# EAGLE schematic PCB-RPIBO1 (EAGLE 6.5.0)
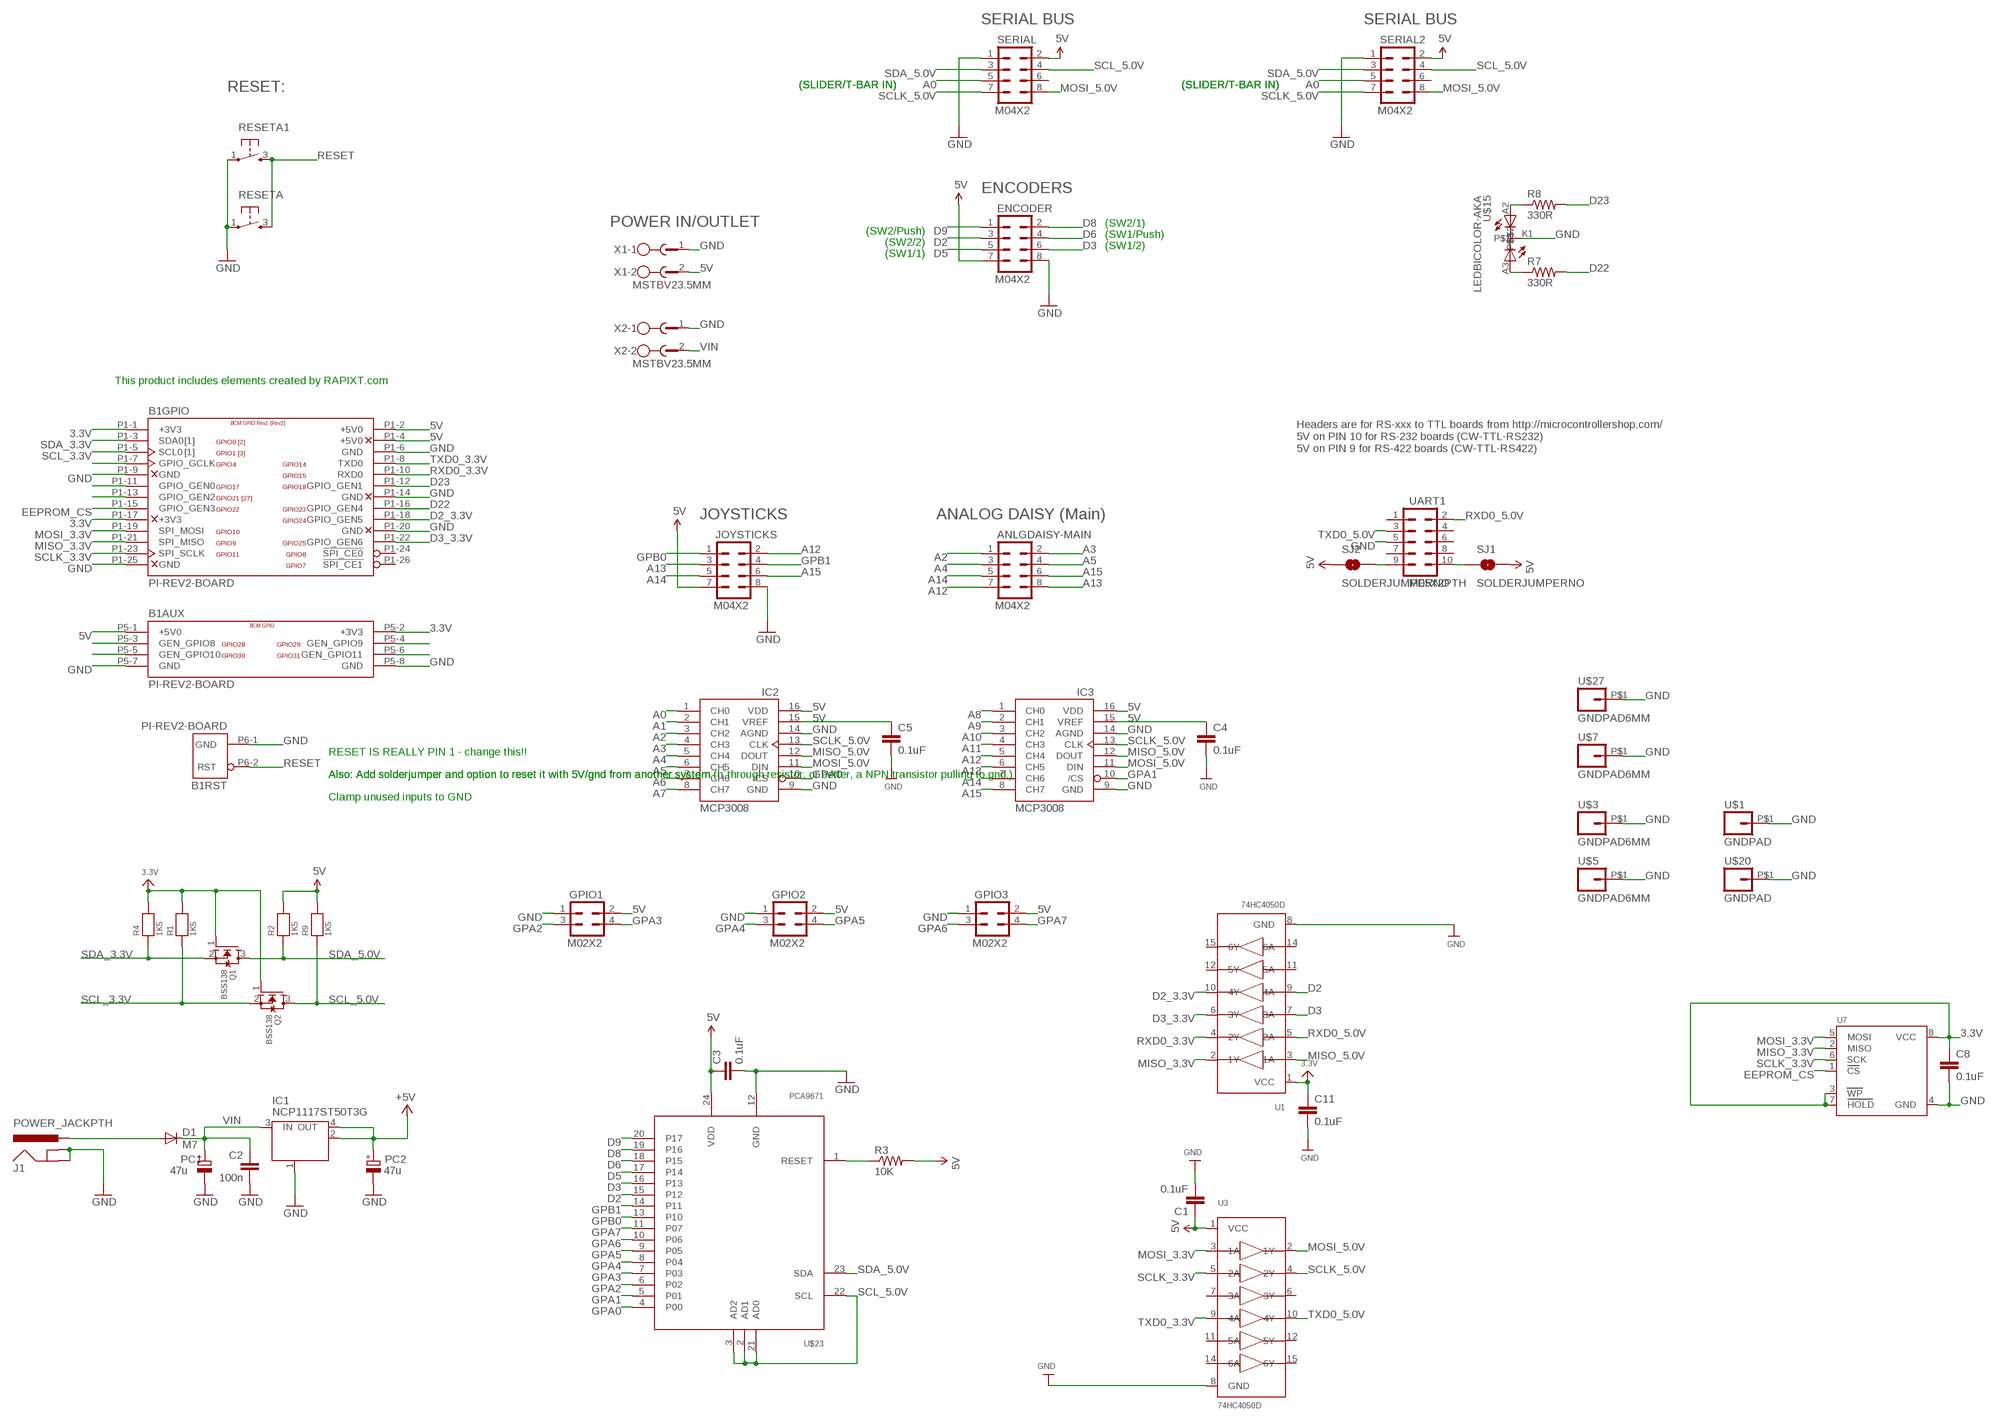
[diagram p0: schematic, sheet 1]

## Parts
ANLGDAISY-MAIN  M04X2  [2X4]
B1  PI-REV2-BOARD  [RASPBERRY-PI-REV2]
C1  0.1uF  CAP0603-CAP  [0603-CAP]
C2  100n  C-EU0603-RND  [C0603-ROUND]
C3  0.1uF  CAP0603-CAP  [0603-CAP]
C4  0.1uF  CAP0603-CAP  [0603-CAP]
C5  0.1uF  CAP0603-CAP  [0603-CAP]
C8  0.1uF  CAP0603-CAP  [0603-CAP]
C11  0.1uF  CAP0603-CAP  [0603-CAP]
D1  M7  DIODE-SMB  [SMB]
ENCODER  M04X2  [2X4]
GPIO1  M02X2  [2X2]
GPIO2  M02X2  [2X2]
GPIO3  M02X2  [2X2]
IC1  NCP1117ST50T3G  MC33269ST-3.3T3  [SOT223]
IC2  MCP3008SOIC  [SOIC16]
IC3  MCP3008SOIC  [SOIC16]
J1  POWER_JACKPTH  [POWER_JACK_PTH]
JOYSTICKS  M04X2  [2X4]
PC1  47u  CPOL-EUD  [PANASONIC_D]
PC2  47u  CPOL-EUD  [PANASONIC_D]
Q1  BSS138  MOSFET-NWIDE  [SOT23-WIDE]
Q2  BSS138  MOSFET-NWIDE  [SOT23-WIDE]
R1  1K5  RESISTOR0603  [0603]
R2  1K5  RESISTOR0603  [0603]
R3  10K  RESISTOR0603-RES  [0603-RES]
R4  1K5  RESISTOR0603  [0603]
R7  330R  RESISTOR0603-RES  [0603-RES]
R8  330R  RESISTOR0603-RES  [0603-RES]
R9  1K5  RESISTOR0603  [0603]
RESETA  TAC_SWITCH  [PUSHBUTTON]
RESETA1  TAC_SWITCH  [PUSHBUTTON]
SERIAL  M04X2  [2X4]
SERIAL2  M04X2  [2X4]
SJ1  SOLDERJUMPERNO  [SJ_2S-NO]
SJ2  SOLDERJUMPERNO  [SJ_2S-NO]
U1  74HC4050D  74HC4050DTSSOP16  [TSSOP16]
U3  74HC4050D  74HC4050DTSSOP16  [TSSOP16]
U7  EEPROM_SPI_AT25040ATSSOP  [TSSOP8-4.4MM]
U$1  GNDPAD  [3.2MMPAD]
U$3  GNDPAD6MM  [3.2MMPAD6MM]
U$5  GNDPAD6MM  [3.2MMPAD6MM]
U$7  GNDPAD6MM  [3.2MMPAD6MM]
U$15  LEDBICOLOR-AKA  [LED5MM-BICOLOR]
U$20  GNDPAD  [3.2MMPAD]
U$23  PCA9671  [TSSOP24]
U$27  GNDPAD6MM  [3.2MMPAD6MM]
UART1  M05X2PTH  [AVR_ICSP]
X1  MSTBV23.5MM  [MSTBV2-3.5]
X2  MSTBV23.5MM  [MSTBV2-3.5]

## Nets
3.3V [Power]: B1.P1-1(GPIO:+3V3) B1.P1-17(GPIO:+3V3) B1.P5-2(AUX:+3V3) C8.1 C11.1 Q1.1(G) Q2.1(G) R1.2 R4.2 U1.1(VCC) U7.3(WP) U7.7(HOLD) U7.8(VCC)
5V [Power]: B1.P1-2(GPIO:+5V0) B1.P1-4(GPIO:+5V0) B1.P5-1(AUX:+5V0) C1.1 C3.1 C4.1 C5.1 ENCODER.7 GPIO1.2 GPIO2.2 GPIO3.2 IC1.2(OUT) IC1.4(OUT) IC2.15(VREF) IC2.16(VDD) IC3.15(VREF) IC3.16(VDD) JOYSTICKS.7 PC2.+ R2.2 R3.2 R9.2 SERIAL2.2 SERIAL.2 SJ1.2 SJ2.1 U3.1(VCC) U$23.24(VDD) X1.2 ; supply symbol labelled +5V
12V [Power]: D1.A J1.PWR
A0: IC2.1(CH0) SERIAL2.5 SERIAL.5
A1: IC2.2(CH1)
A2: ANLGDAISY-MAIN.1 IC2.3(CH2)
A3: ANLGDAISY-MAIN.2 IC2.4(CH3)
A4: ANLGDAISY-MAIN.3 IC2.5(CH4)
A5: ANLGDAISY-MAIN.4 IC2.6(CH5)
A6: IC2.7(CH6)
A7: IC2.8(CH7)
A8: IC3.1(CH0)
A9: IC3.2(CH1)
A10: IC3.3(CH2)
A11: IC3.4(CH3)
A12: ANLGDAISY-MAIN.7 IC3.5(CH4) JOYSTICKS.2
A13: ANLGDAISY-MAIN.8 IC3.6(CH5) JOYSTICKS.3
A14: ANLGDAISY-MAIN.5 IC3.7(CH6) JOYSTICKS.5
A15: ANLGDAISY-MAIN.6 IC3.8(CH7) JOYSTICKS.6
D2: ENCODER.3 U1.9(4A) U$23.15(P12)
D2_3.3V: B1.P1-18(GPIO:GPIO_GEN5) U1.10(4Y)
D3: ENCODER.6 U1.7(3A) U$23.16(P13)
D3_3.3V: B1.P1-22(GPIO:GPIO_GEN6) U1.6(3Y)
D5: ENCODER.5 U$23.17(P14)
D6: ENCODER.4 U$23.18(P15)
D8: ENCODER.2 U$23.19(P16)
D9: ENCODER.1 U$23.20(P17)
D22: B1.P1-16(GPIO:GPIO_GEN4) R7.2
D23: B1.P1-12(GPIO:GPIO_GEN1) R8.2
EEPROM_CS: B1.P1-15(GPIO:GPIO_GEN3) U7.1(CS)
GND [Power]: B1.P1-6(GPIO:GND) B1.P1-9(GPIO:GND) B1.P1-14(GPIO:GND) B1.P1-20(GPIO:GND) B1.P1-25(GPIO:GND) B1.P5-7(AUX:GND) B1.P5-8(AUX:GND) B1.P6-1(RST:GND) C1.2 C2.2 C3.2 C4.2 C5.2 C8.2 C11.2 ENCODER.8 GPIO1.1 GPIO2.1 GPIO3.1 IC1.1(GND/ADJ) IC2.9(GND) IC2.14(AGND) IC3.9(GND) IC3.14(AGND) J1.GND J1.SHUNT(GNDBREAK) JOYSTICKS.8 PC1.- PC2.- RESETA1.1 RESETA.1 SERIAL2.1 SERIAL.1 U1.8(GND) U3.8(GND) U7.4(GND) U$1.P$1 U$3.P$1 U$5.P$1 U$7.P$1 U$15.K1 U$20.P$1 U$23.12(GND) U$27.P$1 UART1.5 X1.1 X2.1
GPA0: IC2.10(/CS) U$23.4(P00)
GPA1: IC3.10(/CS) U$23.5(P01)
GPA2: GPIO1.3 U$23.6(P02)
GPA3: GPIO1.4 U$23.7(P03)
GPA4: GPIO2.3 U$23.8(P04)
GPA5: GPIO2.4 U$23.9(P05)
GPA6: GPIO3.3 U$23.10(P06)
GPA7: GPIO3.4 U$23.11(P07)
GPB0: JOYSTICKS.1 U$23.13(P10)
GPB1: JOYSTICKS.4 U$23.14(P11)
MISO_3.3V: B1.P1-21(GPIO:SPI_MISO) U1.2(1Y) U7.2(MISO)
MISO_5.0V: IC2.12(DOUT) IC3.12(DOUT) U1.3(1A)
MOSI_3.3V: B1.P1-19(GPIO:SPI_MOSI) U3.3(1A) U7.5(MOSI)
MOSI_5.0V: IC2.11(DIN) IC3.11(DIN) SERIAL2.8 SERIAL.8 U3.2(1Y)
N$1: R3.1 U$23.1(RESET)
N$9: SJ2.2 UART1.9
N$10: SJ1.1 UART1.10
N$17: R8.1 U$15.A2
N$22: R7.1 U$15.A3
N$24: B1.P1-13(GPIO:GPIO_GEN2)
N$25: B1.P1-11(GPIO:GPIO_GEN0)
N$27: B1.P1-7(GPIO:GPIO_GCLK)
N$34: B1.P5-4(AUX:GEN_GPIO9)
N$35: B1.P5-6(AUX:GEN_GPIO11)
N$38: B1.P5-3(AUX:GEN_GPIO8)
N$39: B1.P5-5(AUX:GEN_GPIO10)
RESET: B1.P6-2(RST:RST) RESETA1.3 RESETA.3
RXD0_3.3V: B1.P1-10(GPIO:RXD0) U1.4(2Y)
RXD0_5.0V: U1.5(2A) UART1.2
SCL_3.3V: B1.P1-5(GPIO:SCL0) Q2.2(S) R1.1
SCL_5.0V: Q2.3(D) R9.1 SERIAL2.4 SERIAL.4 U$23.2(AD1) U$23.3(AD2) U$23.21(AD0) U$23.22(SCL)
SCLK_3.3V: B1.P1-23(GPIO:SPI_SCLK) U3.5(2A) U7.6(SCK)
SCLK_5.0V: IC2.13(CLK) IC3.13(CLK) SERIAL2.7 SERIAL.7 U3.4(2Y)
SDA_3.3V: B1.P1-3(GPIO:SDA0) Q1.2(S) R4.1
SDA_5.0V: Q1.3(D) R2.1 SERIAL2.3 SERIAL.3 U$23.23(SDA)
TXD0_3.3V: B1.P1-8(GPIO:TXD0) U3.9(4A)
TXD0_5.0V: U3.10(4Y) UART1.3
VIN [Power]: C2.1 D1.C IC1.3(IN) PC1.+ X2.2
Unconnected: B1.P1-24(GPIO:!SPI_CE0) B1.P1-26(GPIO:!SPI_CE1) SERIAL2.6 SERIAL.6 U1.11(5A) U1.12(5Y) U1.14(6A) U1.15(6Y) U3.6(3Y) U3.7(3A) U3.11(5A) U3.12(5Y) U3.14(6A) U3.15(6Y) UART1.1 UART1.4 UART1.6 UART1.7 UART1.8

## Notes on the sheet
- SERIAL BUS | SERIAL BUS
- (SLIDER/T-BAR IN) | (SLIDER/T-BAR IN) | (SLIDER/T-BAR IN) | (SLIDER/T-BAR IN)
- RESET:
- ENCODERS
- POWER IN/OUTLET | (SW2/Push) | (SW2/1)
- (SW2/2) | (SW1/Push)
- (SW1/1) | (SW1/2)
- This product includes elements created by RAPIXT.com
- Headers are for RS-xxx to TTL boards from http://microcontrollershop.com/
  5V on PIN 10 for RS-232 boards (CW-TTL-RS232)
  5V on PIN 9 for RS-422 boards (CW-TTL-RS422)
- JOYSTICKS | ANALOG DAISY (Main)
- RESET IS REALLY PIN 1 - change this!!
- Also: Add solderjumper and option to reset it with 5V/gnd from another system | Also: Add solderjumper and option to reset it with 5V/gnd from another system (h´through resistor, or better, a NPN transistor pulling to gnd.)
- Clamp unused inputs to GND

## Library data of the parts
ANLGDAISY-MAIN ENCODER JOYSTICKS SERIAL SERIAL2 = SparkFun:M04X2
B1 = SKAARHOJ:PI-REV2-: Raspberry Pi Rev2
C1 C3-C5 C8 C11 = SparkFun:CAP: Capacitor Standard 0603 ceramic capacitor, and 0.1" leaded capacitor.
C2 = SmartPrj:C-EU: CAPACITOR, European symbol
D1 = diode:DIODE-: DIODE
GPIO1-GPIO3 = SKAARHOJ:M02X2
IC1 = linear:MC33269ST*: Adjustable Output Low Dropout Voltage Regulator 800 mA Source: http://www.onsemi.com/pub/Collateral/MC33269-D.PDF
IC2 IC3 = SKAARHOJ:MCP3008
J1 = SKAARHOJ:POWER_JACK: RASM712PX Right Angle SMT Mount DC Power Jack, pin size 0.100"(2.5mm), with locating post Switchcraft.com
PC1 PC2 = rcl:CPOL-EU: POLARIZED CAPACITOR, European symbol
Q1 Q2 = microbuilder:MOSFET-N: N-Channel Mosfet LEGEND VDS: Voltage Drain-Source ID: Drain Current RDS(ON): Drain-Source On-State Resistance VGS(TH): Gate-Source Threshold Voltage CISS: Drain-Source Input Capacitance SOT-23 Name VDS ID RDS(ON) VGS(TH) CISS Order Number 2N7002E 60V 260mA 2.5 Ohm 2.5V @ 250uA 26.7pF @ 25V 2N7002ET1GOSTR-ND BSH103 30V 850mA 400 mOhm 400mV @ 1mA 83pF @ 24V BSH103,235-ND BSS138 60V 320mA 1.6 Ohm 1.5V @ 250uA 50pF @ 10V Mouser: 771-BSS138PW115 DMN2075U-7 20V 4.2A 38 mOhm 1V @ 250 uA 594.3pF @ 10V DMN2075U-7DICT-ND * BSS138 good choice for I2C level-shifting
R1 R2 R4 R9 = microbuilder:RESISTOR: Resistors 0402 - 0402 Surface Mount Package 22 Ohm 1% 1/16W [Digikey: 311-22.0LRTR-ND] 33 Ohm 5% 1/16W 1.0K 5% 1/16W 1.5K 5% 1/16W 2.0K 1% 1/16W 10.0K 1% 1/16W [Digikey: 311-10.0KLRTR-ND] 10.0K 5% 1/16W [Digikey: RMCF0402JT10K0TR-ND] 12.1K 1% 1/16W [Digikey: 311-22.0LRTR-ND] 100.0K 5% 1/16W 0603 - 0603 Surface Mount Package 0 Ohm 1/10 Watt 1% Resistor 15 Ohm 1/10 Watt 1% Resistor 33 Ohm 1/10 Watt 1% Resistor 49.9 Ohm 1/10 Watt 1% Resistor 100 Ohm 1/10 Watt 1% Resistor 150 Ohm 1/10 Watt 1% Resistor 240 Ohm 1/10 Watt 1% Resistor 390 Ohm 1/10 Watt 1% Resistor 560 Ohm 1/10 Watt 1% Resistor 680 Ohm 1/10 Watt 1% Resistor 750 Ohm 1/10 Watt 1% Resistor 1.0K Ohm 1/10 Watt 1% Resistor 1.5K Ohm 1/10 Watt 1% Resistor 2.0K Ohm 1/10 Watt 1% Resistor 2.2K Ohm 1/10 Watt 1% Resistor 3.3K Ohm 1/10 Watt 1% Resistor 4.7K Ohm 1/10 Watt 1% Resistor 10.0K Ohm 1/10 Watt 1% Resistor 12.0K Ohm 1/10 Watt 1% Resistor 12.1K Ohm 1/10 Watt 1% Resistor 20.0K Ohm 1/10 Watt 1% Resistor 33.0K Ohm 1/10 Watt 1% Resistor 100.0K Ohm 1/10 Watt 1% Resistor 0805 - 0805 Surface Mount Package 0 Ohm 1/8 Watt 1% Resistor 33 Ohm 1/8 Watt 1% Resistor 100 Ohm 1/8 Watt 1% Resistor 150 Ohm 1/8 Watt 1% Resistor 200 Ohm 1/8 Watt 1% Resistor 240 Ohm 1/8 Watt 1% Resistor 330 Ohm 1/8 Watt 1% Resistor 390 Ohm 1/8 Watt 1% Resistor 470 Ohm 1/8 Watt 1% Resistor 1.0K Ohm 1/8 Watt 1% Resistor 1.5K Ohm 1/8 Watt 1% Resistor 2.0K Ohm 1/8 Watt 1% Resistor 4.7K Ohm 1/8 Watt 1% Resistor 5.1K Ohm 1/8 Watt 1% Resistor 5.6K Ohm 1/8 Watt 1% Resistor 10.0K Ohm 1/8 Watt 1% Resistor 22.0K Ohm 1/8 Watt 1% Resistor 33.0K Ohm 1/8 Watt 1% Resistor 100K Ohm 1/8 Watt 1% Resistor 1206 - 1206 Surface Mount Package 2012 - 2010 Surface Mount Package 0.11 Ohm 1/2 Watt 1% Resistor - Digikey: RHM.11UCT-ND
R3 R7 R8 = SparkFun:RESISTOR: Resistor Basic schematic elements and footprints for 0603, 1206, and PTH resistors.
RESETA RESETA1 = SKAARHOJ:TAC_SWITCH: Momentary Switch Button commonly used for reset or general input. Spark Fun Electronics SKU : COM-00097
SJ1 SJ2 = SparkFun:SOLDERJUMPER: Solder Jumper Standard SMD solder jumper. Used to automate production. Two varients : Normally Open and Normally Closed are the same, but have different paste layers. NC will have a large amount of paste and should jumper during reflow.
U1 U3 = SKAARHOJ:74HC4050D: 6-channel level shifter 74HC4050D - 2V-6V Supply Digikey: 74HC4050D,653-ND Mouser: 771-74HC4050D-T
U7 = microbuilder:EEPROM_SPI_AT25040A: AT25010a/40a EEPROM SOIC8 AT25010a, 1K (128 x 8 bit) - Digikey: AT25010AN-10SU2.7-ND AT25040a, 4K (256 x 8 bit) - Digikey: AT25040AN-10SU1.8-ND TSSOP8 AT25010a, 1K (128 x 8 bit) - Digikey: AT25010A-10TU-1.8-ND AT25040a, 4K (256 x 8 bit) - Digikey: AT25040A-10TU-1.8-ND
U$1 U$3 U$5 U$7 U$20 U$27 = SKAARHOJ:GNDPAD
U$15 = SKAARHOJ:LEDBICOLOR-AKA
U$23 = SKAARHOJ:PCA9671
UART1 = SparkFun:M05X2: Header 5x2 Standard 10-pin dual row 0.1" header. Commonly used with AVR-ISP. Use with Spark Fun Electronics SKU: PRT-00778
X1 X2 = SKAARHOJ:MSTBV2: PHOENIX

## Net classes
0 default: width 0.203 mm, drill 0.406 mm, clearance 0.152 mm
1 Power: width 0.508 mm, drill 0.61 mm, clearance 0.203 mm
3 INput lines: clearance 0.203 mm